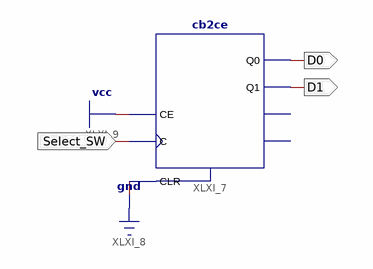
[diagram p0: schematic sheet 1]
// Xilinx ISE schematic select_button.sch (spartan6) as structural Verilog: 1 symbols, 3 ports
module select_button (
  input  Select_SW,
  output D0,
  output D1
);

  cb2ce XLXI_7 (.C(Select_SW), .CE(1'b1), .CLR(1'b0), .Q0(D0), .Q1(D1));  // open: CEO, TC
endmodule
